# EAGLE design 89c2051-wy85-ps2 (EAGLE 4.16)
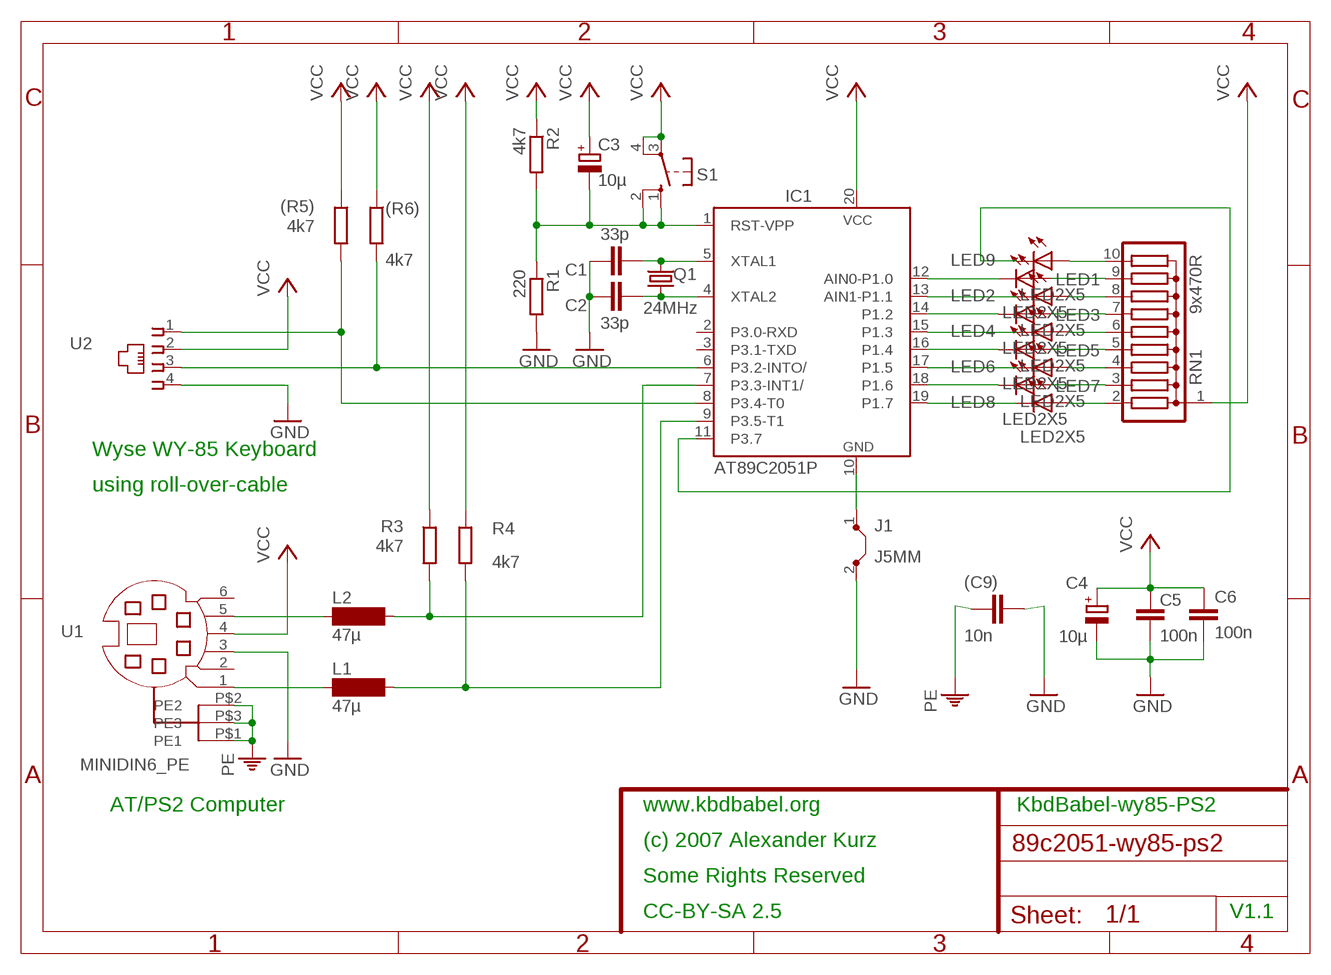
[diagram p0: schematic, sheet 1]

## Parts
(C9)  10n  C-EU025_050-025X075  [C025_050-025X075]
(R5)  4k7  R-EU_0204/7  [0204/7]
(R6)  4k7  R-EU_0204/7  [0204/7]
C1  33p  C-EU025-030X050  [C025-030X050]
C2  33p  C-EU025-030X050  [C025-030X050]
C3  10µ  CPOL-EUE2-5  [E2-5]
C4  10µ  CPOL-EUE2-5  [E2-5]
C5  100n  C-EU025_050-025X075  [C025_050-025X075]
C6  100n  C-EU025_050-025X075  [C025_050-025X075]
IC1  AT89C2051P  [DIL20]
J1  J5MM  [05]
L1  47µ  SD75  [SD75]
L2  47µ  SD75  [SD75]
LED1  LED2X5  [LED2X5]
LED2  LED2X5  [LED2X5]
LED3  LED2X5  [LED2X5]
LED4  LED2X5  [LED2X5]
LED5  LED2X5  [LED2X5]
LED6  LED2X5  [LED2X5]
LED7  LED2X5  [LED2X5]
LED8  LED2X5  [LED2X5]
LED9  LED2X5  [LED2X5]
Q1  24MHz  CRYSTALHC49U70  [HC49U70]
R1  220  R-EU_0204/7  [0204/7]
R2  4k7  R-EU_0204/7  [0204/7]
R3  4k7  R-EU_0204/7  [0204/7]
R4  4k7  R-EU_0204/7  [0204/7]
RN1  9x470R  G09R  [SIL10]
S1  10-XX  [B3F-10XX]
U1  MINIDIN6_PE  [MINIDIN6_PE]
U2  520249-2  [520249-2]

## Nets
GND: (C9).1 C1.1 C2.2 C4.- C5.1 C6.2 J1.2 R1.2 U1.3 U2.4
N$1: C1.2 IC1.5(XTAL1) Q1.2
N$2: C2.1 IC1.4(XTAL2) Q1.1
N$3: IC1.10(GND) J1.1
N$4: IC1.12(AIN0-P1.0) LED1.K(C)
N$5: IC1.13(AIN1-P1.1) LED2.K(C)
N$6: L2.1 U1.5
N$7: (R6).2 IC1.6(P3.2-INTO/) U2.3
N$8: IC1.14(P1.2) LED3.K(C)
N$9: C3.- IC1.1(RST-VPP) R1.1 R2.2 S1.1(S) S1.2(S1)
N$10: (R5).2 IC1.8(P3.4-T0) U2.1
N$11: IC1.15(P1.3) LED4.K(C)
N$12: IC1.9(P3.5-T1) L1.2 R4.2
N$13: IC1.16(P1.4) LED5.K(C)
N$14: IC1.17(P1.5) LED6.K(C)
N$15: IC1.18(P1.6) LED7.K(C)
N$16: IC1.19(P1.7) LED8.K(C)
N$17: LED8.A RN1.2
N$18: LED7.A RN1.3
N$19: LED6.A RN1.4
N$20: LED5.A RN1.5
N$21: LED4.A RN1.6
N$22: LED3.A RN1.7
N$23: LED2.A RN1.8
N$24: LED1.A RN1.9
N$25: LED9.A RN1.10
N$26: L1.1 U1.1
N$28: IC1.11(P3.7) LED9.K(C)
N$30: IC1.7(P3.3-INT1/) L2.2 R3.2
PE: (C9).2 U1.P$1(PE1) U1.P$2(PE2) U1.P$3(PE3)
VCC: (R5).1 (R6).1 C3.+ C4.+ C5.2 C6.1 IC1.20(VCC) R2.1 R3.1 R4.1 RN1.1 S1.3(P) S1.4(P1) U1.4 U2.2
Unconnected: IC1.2(P3.0-RXD) IC1.3(P3.1-TXD) U1.2 U1.6

## Notes on the sheet
- Wyse WY-85 Keyboard
- using roll-over-cable
- AT/PS2 Computer | www.kbdbabel.org | KbdBabel-wy85-PS2
- (c) 2007 Alexander Kurz
- Some Rights Reserved
- CC-BY-SA 2.5 | V1.1

## Library data of the parts
(C9) C1 C2 C5 C6 = rcl:C-EU: CAPACITOR, European symbol
(R5) (R6) R1-R4 = rcl:R-EU_: RESISTOR, European symbol
C3 C4 = rcl:CPOL-EU: POLARIZED CAPACITOR, European symbol
IC1 = atmel:AT89C2051: 80C31 MICROCONTROLLER 2 Kbytes FLASH 2.7 V
J1 = jumper:J: Bridge
L1 L2 = inductor-neosid:SD75: INDUCTOR nominal inductance, E12
LED1-LED9 = bla:LED
Q1 = crystal:CRYSTAL: CRYSTAL
RN1 = resistor-sil:G09R: SIL RESISTOR
S1 = switch-omron:10-XX: OMRON SWITCH
U1 = bla:MINIDIN6_PE
U2 = con-amp:520249-2: AMP connector

## Board
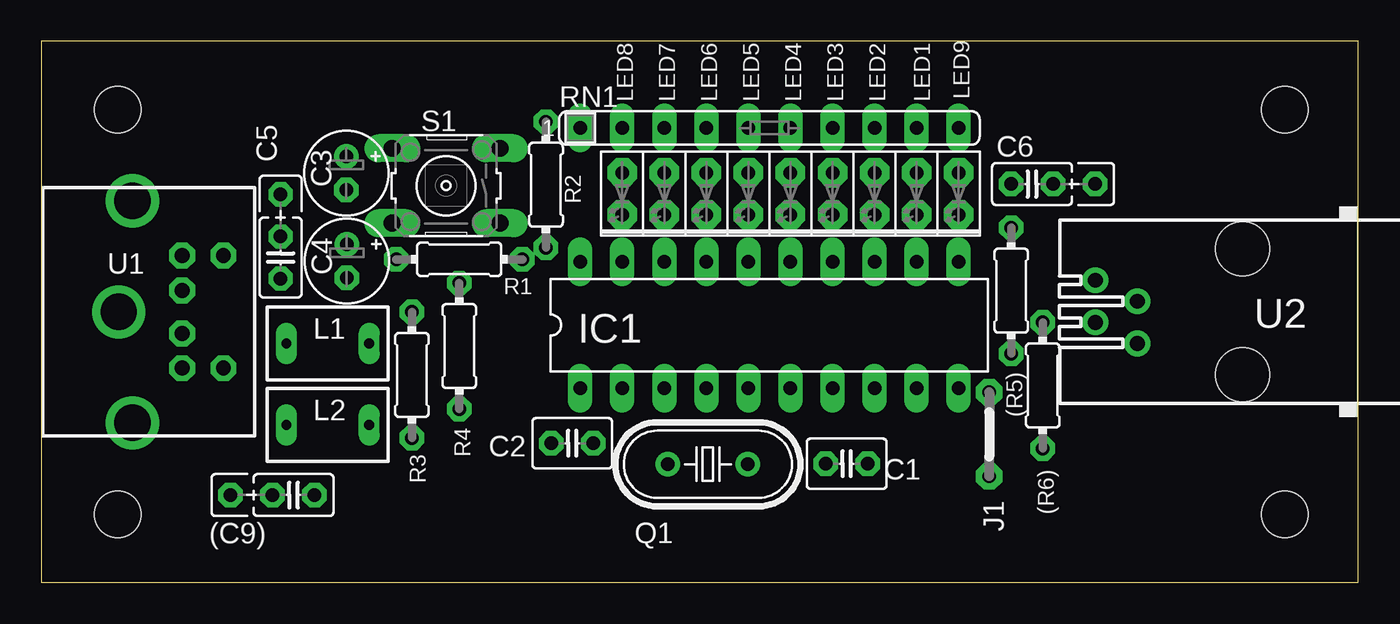
[diagram p1: board, top side]
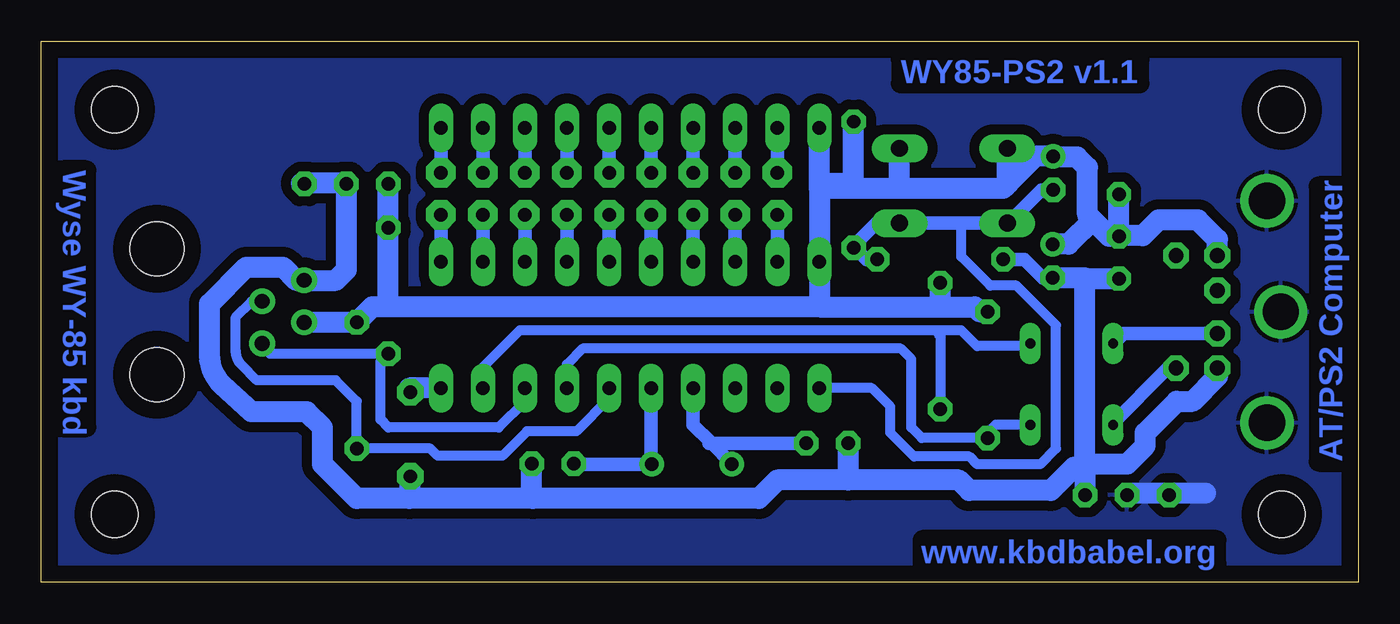
[diagram p2: board, bottom side, seen from below]

Size 79.52 x 32.69 mm. Coordinates in mm from the lower left corner, seen from the top.
Outline: 79.52,0 79.52,32.69 0,32.69 0,0 79.52,0
Copper layers (1*16): Top 0.035mm / dielectric 1.5mm / Bottom 0.035mm
Design rules "default": minimum track width 16mil, minimum drill 24mil, track to track 16mil, track to pad 16mil, pad to pad 16mil, via to via 16mil, smd to smd 16mil, copper to edge 40mil, drill to drill 8mil, minimum pad ring 13mil, minimum via ring 8mil, stop-mask expansion 4mil, vias tented up to drill 0mil, thermal gap 10mil
Holes 2.8 mm at 75.08,4.12 75.08,28.57 4.6,28.57 4.6,4.12

### Footprints (pad centres in the part's own frame; a part is rotated, then mirrored left to right if it is on the bottom)
C025_050-025X075 = drill 0.813 octagon: 1 -1.27,0; 2 1.27,0; 3 3.81,0
0204/7 = drill 0.813 octagon: 1 -3.81,0; 2 3.81,0
C025-030X050 = drill 0.813 octagon: 1 -1.27,0; 2 1.27,0
E2-5 = drill 0.813 pad 1.27 round: + -1.016,0 | drill 0.813 pad 1.27 octagon: - 1.016,0
DIL20 = drill 0.813 long: 1 -11.43,-3.81; 2 -8.89,-3.81; 3 -6.35,-3.81; 4 -3.81,-3.81; 5 -1.27,-3.81; 6 1.27,-3.81; 7 3.81,-3.81; 8 6.35,-3.81; 9 8.89,-3.81; 10 11.43,-3.81; 11 11.43,3.81; 12 8.89,3.81; 13 6.35,3.81; 14 3.81,3.81; 15 1.27,3.81; 16 -1.27,3.81; 17 -3.81,3.81; 18 -6.35,3.81; 19 -8.89,3.81; 20 -11.43,3.81
05 = drill 0.813 pad 1.6 octagon: 1 -2.54,0; 2 2.54,0
SD75 = drill 0.6 long: 1 -2.5,0; 2 2.5,0
LED2X5 = drill 0.813 pad 1.778 octagon: A -1.27,0; K 1.27,0
HC49U70 = drill 0.813 round: 1 -2.413,0; 2 2.413,0
SIL10 = drill 0.813 long: 1 -11.43,0; 2 -8.89,0; 3 -6.35,0; 4 -3.81,0; 5 -1.27,0; 6 1.27,0; 7 3.81,0; 8 6.35,0; 9 8.89,0; 10 11.43,0
B3F-10XX = drill 1.016 long: 1 -3.251,2.261; 2 3.251,2.261; 3 -3.251,-2.261; 4 3.251,-2.261
MINIDIN6_PE = drill 0.9 octagon: 1 1.3,2.15; 2 -1.3,2.15; 3 3.4,2.15; 4 -3.4,2.15; 5 3.4,4.65; 6 -3.4,4.65 | drill 2.2 round: P$1 0,-1.676; P$2 -6.706,-0.838; P$3 6.706,-0.838
520249-2 = drill 0.889 round: 1 -1.905,6.35; 2 -0.635,8.89; 3 0.635,6.35; 4 1.905,8.89 | hole 3.251: -3.81,0; 3.81,0

### Placement (x,y rotation side)
(C9)  15.23,5.28 180 top
(R5)  58.57,17.63 270 top
(R6)  60.48,11.9 270 top
C1  48.64,7.17 180 top
C2  32.06,8.41 180 top
C3  18.41,24.73 270 top
C4  18.44,19.42 270 top
C5  14.45,19.63 90 top
C6  59.83,24.07 0 top
IC1  43.97,15.55 0 top
J1  57.24,8.95 270 top
L1  17.3,14.44 0 top
L2  17.3,9.52 0 top
LED1  52.86,23.49 270 top
LED2  50.32,23.49 270 top
LED3  47.78,23.49 270 top
LED4  45.24,23.49 270 top
LED5  42.7,23.49 270 top
LED6  40.16,23.49 270 top
LED7  37.62,23.49 270 top
LED8  35.08,23.49 270 top
LED9  55.4,23.49 270 top
Q1  40.25,7.14 0 top
R1  25.24,19.52 180 top
R2  30.47,24.03 270 top
R3  22.38,12.53 270 top
R4  25.24,14.28 270 top
RN1  43.97,27.46 0 top
S1  24.44,23.96 180 top
U1  6.34,16.34 270 top
U2  72.54,16.34 90 top

### Tracks (layer width: path | path; a pad name or v marks a point on that pad's centre or on a via)
GND
  Bottom 0.813: C4.- 19.04,18.4 20.16,19.52 21.58,19.52 R1.2
  Bottom 1.27: 49.84,5.07 57.3,5.07 | 57.3,5.07 60.48,5.07 | 60.48,5.07 | 60.48,5.07 62.54,7.14 62.54,9.36 63.49,10.31 66.83,10.31 68.61,11.94 arc45 69.37,13.76 69.37,16.82 67.15,19.04 64.92,19.04 64.13,18.25 U2.4 61.75,18.25 61.1,18.9 C6.2 61.1,23.98 61.11,23.96 61.11,24.12 63.81,24.12 | J1.2 57.24,5.14 57.3,5.07 | C1.1 49.91,5.14 49.84,5.07 | 16.5,18.4 C4.- | 16.5,7.14 16.5,6.98 | 16.5,7.14 16.5,18.4 | 16.5,18.4 16.5,18.41 16.45,18.36 C5.1 | U1.3 8.49,12.45 10,10.95 10.95,10.95 12.85,9.04 12.85,8.25 13.96,7.14 16.5,7.14 | 16.5,6.98 16.35,6.98 | 16.5,6.98 17.14,6.98 18.57,5.55 23.49,5.55 24.12,6.18 30.79,6.18 | (C9).1 16.5,7.13 16.5,7.14 | 49.84,5.07 36.19,5.07 35.08,6.18 30.79,6.18 | 30.79,6.18 C2.2
N$1
  Bottom 0.813: Q1.2 42.7,7.14 | 42.7,7.14 IC1.5 | C1.2 47.43,7.17 47.46,7.14 42.7,7.14
N$2
  Bottom 0.813: Q1.1 37.78,7.14 39.13,8.49 | IC1.4 40.16,9.52 39.13,8.49 | 39.21,8.41 39.13,8.49 | C2.1 39.21,8.41 | 39.21,8.41
N$3
  Bottom 1.27: 57.3,11.49 57.3,11.42 | 57.3,11.49 J1.1 | IC1.10 57.3,11.74 57.3,11.49
N$4
  Bottom 0.813: IC1.12 LED1.K
N$5
  Bottom 0.813: IC1.13 LED2.K
N$6
  Bottom 0.813: 14.92,9.52 | L2.1 14.92,9.52 | U1.5 11.49,12.94 14.92,9.52
N$7
  Bottom 0.61: (R6).2 56.03,8.09 55.59,7.65 51.68,7.65 50.19,9.14 47.21,9.14 45.24,11.11 IC1.6 | U2.3 66.83,16.98 67.78,16.03 67.78,13.97 arc-45 67.44,13.15 66.51,12.22 61.75,12.22 60.48,10.95 (R6).2 | (R6).2
N$8
  Bottom 0.813: LED3.K IC1.14
N$9
  Bottom 0.61: 23.97,21.7 23.97,19.68 22.22,17.93 20.63,17.93 18.25,15.55 18.25,8.09 19.2,7.14 23.01,7.14 23.49,7.61 26.82,7.61 28.25,9.04 28.25,10.63 29.36,11.74 IC1.1 | IC1.1
  Bottom 0.813: 21.19,21.66 21.27,21.58 | S1.2 21.19,21.66 | C3.- 19.14,23.71 21.19,21.66 | 27.74,21.7 S1.1 | 23.97,21.7 S1.2 | 23.97,21.7 27.74,21.7 | 27.74,21.7 27.78,21.74 | 30.57,20.22 30.63,20.15 | 30.57,20.22 R2.2 30.47,20.31 29.68,19.52 R1.1 | 27.74,21.7 29.08,21.7 30.57,20.22 | S1.2 21.23,21.7 21.27,21.74 21.31,21.7 23.97,21.7
N$10
  Bottom 0.61: U2.1 66.19,14.28 65.72,13.8 (R5).2 | (R5).2 | (R5).2 59.05,13.33 59.05,9.84 58.57,9.36 51.91,9.36 50.32,10.95 IC1.8
N$11
  Bottom 0.813: 45.4,19.36 | 45.4,19.36 IC1.15 | LED4.K 45.24,19.52 45.4,19.36
N$12
  Bottom 0.61: IC1.9 | IC1.9 52.86,13.01 50.64,15.23 25.39,15.23 | 25.39,15.23 23.97,15.23 23.01,14.28 20,14.28 19.84,14.44 L1.2 | 25.39,15.23 25.39,15.07 25.24,14.92 R4.2
N$13
  Bottom 0.813: IC1.16 LED5.K
N$14
  Bottom 0.813: IC1.17 LED6.K
N$15
  Bottom 0.813: 37.62,22.38 LED7.K IC1.18
N$16
  Bottom 0.813: 35.08,19.52 IC1.19 | LED8.K 35.08,19.52 | 35.08,19.52
N$17
  Bottom 0.813: LED8.A RN1.2 | RN1.2
N$18
  Bottom 0.813: 37.62,24.6 LED7.A RN1.3
N$19
  Bottom 0.813: LED6.A RN1.4
N$20
  Bottom 0.813: RN1.5 LED5.A
N$21
  Bottom 0.813: LED4.A RN1.6 | RN1.6
N$22
  Bottom 0.813: 47.78,24.6 LED3.A RN1.7
N$23
  Bottom 0.813: LED2.A RN1.8
N$24
  Bottom 0.813: LED1.A | RN1.9 LED1.A
N$25
  Bottom 0.813: LED9.A RN1.10
N$26
  Bottom 0.813: 14.76,14.44 | 14.76,14.44 L1.1 | U1.1 14.15,15.04 14.76,14.44
N$28
  Bottom 0.813: 55.56,19.36 | 55.56,19.36 IC1.11 | LED9.K 55.4,19.52 55.56,19.36
N$30
  Bottom 0.61: IC1.7 | IC1.7 47.78,13.17 46.83,14.12 27.62,14.12 26.98,13.49 26.98,9.36 26.35,8.72 R3.2 | R3.2 | R3.2 22.38,9.04 21.9,9.52 19.84,9.52 | 19.84,9.52 | L2.2 19.84,9.52
PE
  Bottom 1.27: 9.2,5.39 13.96,5.39
  pour Bottom (isolate 0.61): 79.67,-0.13 79.64,32.85 -0.18,32.85 -0.14,-0.1
VCC
  Bottom 1.27: U2.2 | (R6).1 | (R6).1 | (R6).1 U2.2 | (R6).1 | 58.57,16.64 32.56,16.64 32.54,16.64 | 58.57,16.64 59.54,16.64 (R6).1 | (R5).1 58.57,24.12 58.56,24.11 C6.1 | 58.57,16.64 (R5).1 | (R5).1 | R3.1 22.85,16.34 23.15,16.64 25.24,16.64 | 32.54,16.64 25.24,16.64 | 25.24,16.64 25.24,16.82 | 25.24,16.82 R4.1 | 25.24,16.82 | 32.54,16.66 32.54,16.64 | 32.54,16.66 32.51,16.69 | 32.54,16.66 IC1.20 32.54,23.81 | 32.54,23.81 32.54,24.12 | 32.54,24.12 RN1.1 | 32.54,24.12 30.47,24.12 R2.1 | U1.4 8.49,20.72 9.68,21.9 12.06,21.9 13.01,20.95 14.44,20.95 | 21.11,24.12 21.43,23.81 27.78,23.81 | 21.11,24.12 19.49,25.74 C3.+ 18.41,25.71 | 27.78,23.81 32.54,23.81 | S1.3 27.69,23.89 27.78,23.81 | S1.4 21.19,24.21 21.11,24.12 | 16.03,21.9 15.02,20.9 C5.2 14.45,20.94 14.44,20.95 | 16.03,21.9 16.35,22.22 16.35,25.08 16.98,25.71 18.41,25.71 | 18.41,25.71 | C4.+ 17.5,20.43 16.03,21.9 | 14.44,20.95 14.44,23.49

### Text on the board
Bottom: WY85-PS2 v1.1 | Wyse WY-85 kbd | AT/PS2 Computer | www.kbdbabel.org